# Altium schematic sheet cdh.SchDoc
size A3
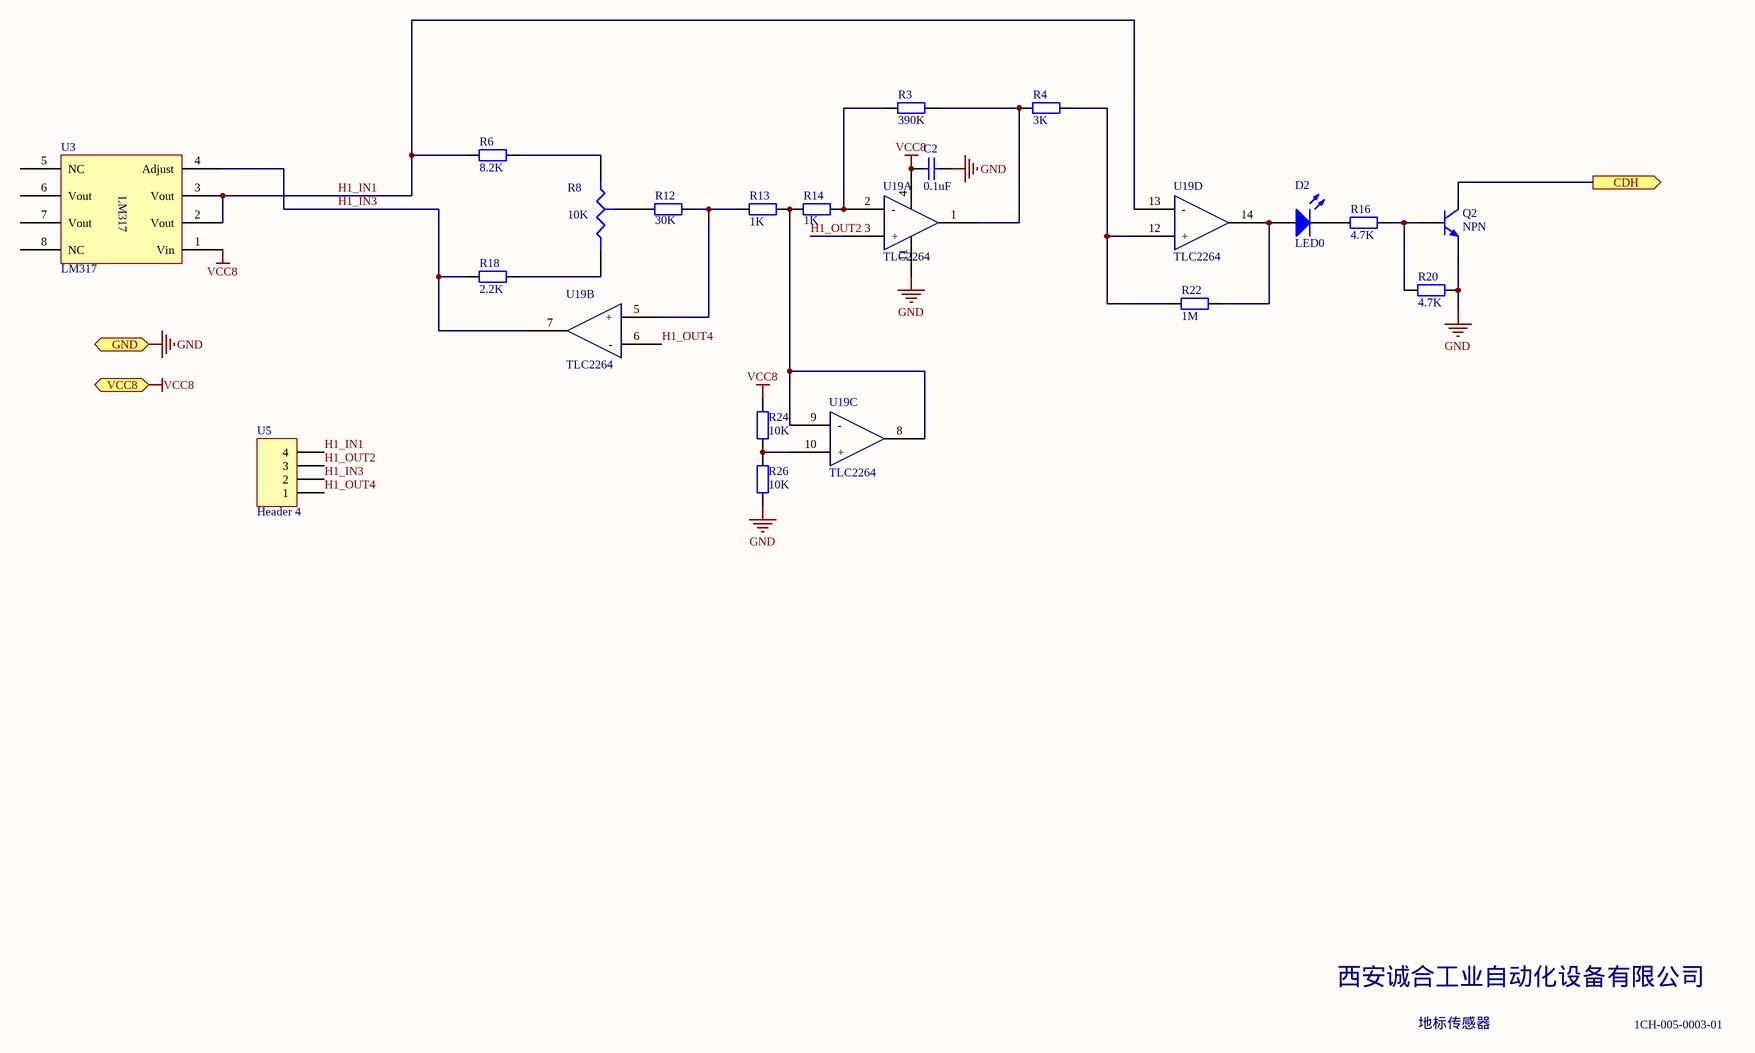
[diagram p0: cdh.SchDoc]

## Parts
C2  0.1uF  [C0805]
D2  LED0  [LED1]
Q2  NPN  [SOT-23]
R3  390K  [0805]
R4  3K  [0805]
R6  8.2K  [0805]
R8  value 10K  [3224W]  (hidden comment: Res Tap)
R12  30K  [0805]
R13  1K  [0805]
R14  1K  [0805]
R16  4.7K  [0603]
R18  2.2K  [0805]
R20  4.7K  [0603]
R22  1M  [0805]
R24  10K  [0805]
R26  10K  [0805]
U3  LM317  [SO-8]
U5  Header 4  [PIN4]
U19  TLC2264  [TSSOP14]  (parts A,B,C,D of 4)

## Ports
CDH (out), GND (bidir), VCC8 (bidir)

## Nets
GND: C2.1 Q2.3(E) R20.2 R26.1 U19.11(GND) ; port GND
VCC8: C2.2 R24.2 U3.1(Vin) U19.4(VCC) ; port VCC8
CDH: Q2.1(C) ; port CDH
H1_IN1: R6.1 U3.2(Vout) U3.3(Vout) U5.4 U19.13(-)
H1_IN3: R18.1 U3.4(Adjust) U5.2 U19.7(2OUT)
H1_OUT2: U5.3 U19.3(+)
H1_OUT4: U5.1 U19.6(-)
NetD2_1: D2.1(A) R22.2 U19.14(4OUT)
NetD2_2: D2.2(K) R16.1
NetQ2_2: Q2.2(B) R16.2 R20.1
NetR3_1: R3.1 R14.1 U19.2(-)
NetR3_2: R3.2 R4.1 U19.1(1OUT)
NetR4_2: R4.2 R22.1 U19.12(+)
NetR6_2: R6.2 R8.1(A)
NetR8_2: R8.2(B) R18.2
NetR8_3: R8.3(TAP) R12.1
NetR12_2: R12.2 R13.1 U19.5(+)
NetR13_2: R13.2 R14.2 U19.8(3OUT) U19.9(-)
NetR24_1: R24.1 R26.2 U19.10(+)

Not connected (* = marked no-connect by the designer): U3 5(NC) 6(Vout) 7(Vout) 8(NC)

## Notes on the sheet
- 西安诚合工业自动化设备有限公司
- 地标传感器
- 1CH-005-0003-01

## Library data of the parts
C2 = Cap Semi: Capacitor (Semiconductor SIM Model); Published: 8-Jun-2000; LatestRevisionDate: 29-May-2009; LatestRevisionNote: IPC-7351 Footprint Added.; PackageReference: C1206; Publisher: Altium Limited; PackageDescription: Chip Capacitor; Value: 0.1uF
D2 = LED0: Typical INFRARED GaAs LED; Published: 8-Jun-2000; LatestRevisionDate: 08-Jul-2005; LatestRevisionNote: Mech Layer 1 removed.; PackageReference: LED-0; Publisher: Altium Limited; PackageDescription: LED; 2 Leads
Q2 = NPN: NPN Bipolar Transistor; Published: 8-Jun-2000; LatestRevisionDate: 17-Jul-2002; LatestRevisionNote: Re-released for DXP Platform.; PackageReference: TO-226-AA; Publisher: Altium Limited; PackageDescription: TO, Flat Index; 3 In-Line, Axial Leads; Body Dia. 4.8mm; Leads 0.55 x 0.51 mm (max); Code_JEDEC: TO-226-AA
R3 R4 R6 R12-R14 R16 R18 R20 R22 R24 R26 = Res2: Resistor; Published: 8-Jun-2000; LatestRevisionDate: 17-Jul-2002; LatestRevisionNote: Re-released for DXP Platform.; PackageReference: AXIAL-0.4; Publisher: Altium Limited; PackageDescription: Axial Device, Thru-Hole; 2 Leads; 0.4 in Pin Spacing
  R3: Value: 390K
  R4: Value: 3K
  R6: Value: 8.2K
  R12: Value: 30K
  R13 R14: Value: 1K
  R16 R20: Value: 4.7K
  R18: Value: 2.2K
  R22: Value: 1M
  R24 R26: Value: 10K
R8 = Res Tap: Tapped Resistor; Sim Note: Enter the Resistance value and the set point into parameter fields.; Set Position: 0.5; Published: 24-Mar-1999; LatestRevisionDate: 17-Jul-2002; LatestRevisionNote: Re-released for DXP Platform.; PackageReference: VR3; Publisher: Altium Limited; PackageDescription: Variable Resistor, Thru-Hole; 3 Leads
U5 = Header 4: Header, 4-Pin; LatestRevisionDate: 17-Jul-2002; LatestRevisionNote: Re-released for DXP Platform.; Publisher: Altium Limited